# Altium project RFSoC-AMC.PrjPCB (part 12 of 22)

## Sheet CDR_WR_oscillators.SchDoc: RFSoC AMC
size 420 x 297 mm; CmpIndex: 26; CompanyName: WUT; DrawnBy: T. Przywozki; Organization: WUT ISE; Address1: Warsaw University of Technology; Address2: Nowowiejska 15/19 00-665 Warsaw; Address3: Tomasz.Przywozki@pw.edu.pl; DocumentNumber: 45; Revision: 1; SheetNumber: 45; SheetTotal: 45; Project: RFSoC AMC; ModifiedBy: T. Przywozki; CreateDate: -; CheckedDate: -; DivGrp: ISE; Designer: T. Przywozki; ModifiedDate: -; ProjectName: ADC/DAC MEZZANINE
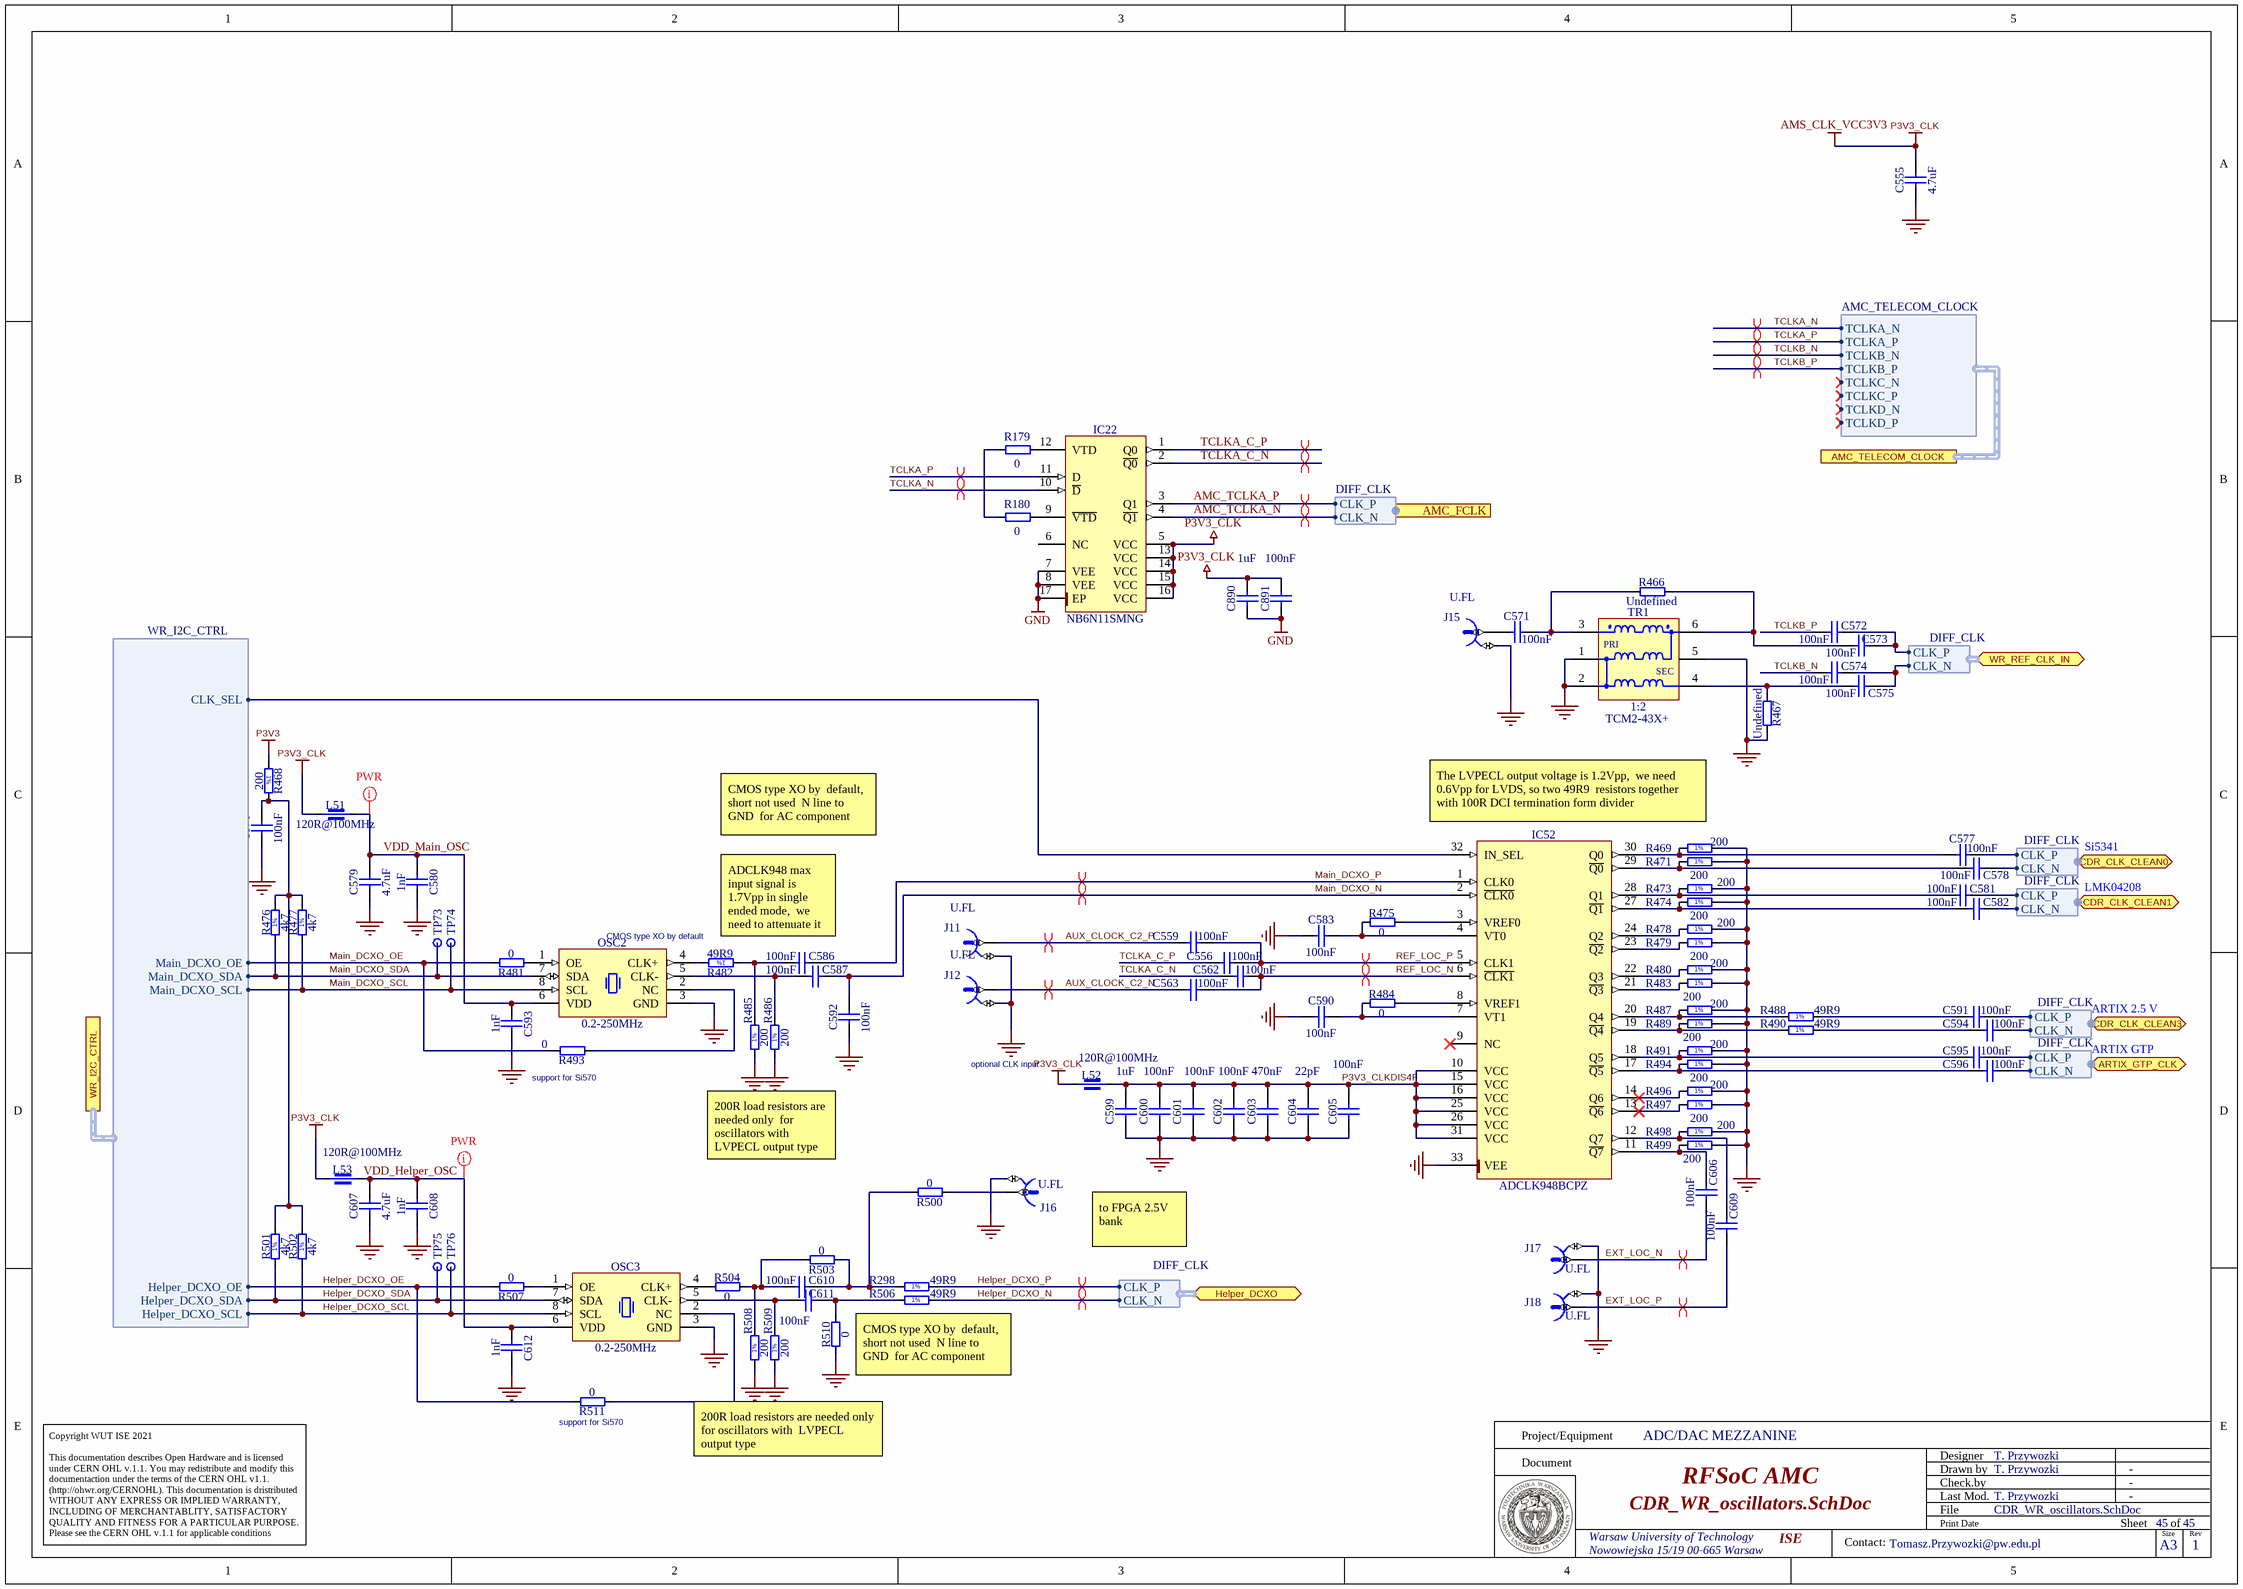
[diagram p25: CDR_WR_oscillators.SchDoc]

### Parts
C555  4.7uF  [CAPC1608X90N]
C556  100nF  [CAPC1005X55N]
C559  100nF  [CAPC1005X55N]
C562  100nF  [CAPC1005X55N]
C563  100nF  [CAPC1005X55N]
C571  100nF  [CAPC1005X55N]
C572  100nF  [CAPC1005X55N]
C573  100nF  [CAPC1005X55N]
C574  100nF  [CAPC1005X55N]
C575  100nF  [CAPC1005X55N]
C576  100nF  [CAPC0603X33N]
C577  100nF  [CAPC0603X33N]
C578  100nF  [CAPC0603X33N]
C579  4.7uF  [CAPC1608X90N]
C580  1nF  [CAPC0603X33N]
C581  100nF  [CAPC0603X33N]
C582  100nF  [CAPC0603X33N]
C583  100nF  [CAPC0603X33N]
C586  100nF  [CAPC1005X55N]
C587  100nF  [CAPC1005X55N]
C590  100nF  [CAPC0603X33N]
C591  100nF  [CAPC0603X33N]
C592  100nF  [CAPC0603X33N]
C593  1nF  [CAPC0603X33N]
C594  100nF  [CAPC0603X33N]
C595  100nF  [CAPC0603X33N]
C596  100nF  [CAPC0603X33N]
C599  1uF  [CAPC1005X55N]
C600  100nF  [CAPC0603X33N]
C601  100nF  [CAPC0603X33N]
C602  100nF  [CAPC0603X33N]
C603  470nF  [CAPC1005X55N]
C604  22pF  [CAPC1005X55N]
C605  100nF  [CAPC0603X33N]
C606  100nF  [CAPC0603X33N]
C607  4.7uF  [CAPC1608X90N]
C608  1nF  [CAPC0603X33N]
C609  100nF  [CAPC0603X33N]
C610  100nF  [CAPC1005X55N]
C611  100nF  [CAPC1005X55N]
C612  1nF  [CAPC0603X33N]
C890  1uF  [CAPC1005X55N]
C891  100nF  [CAPC0603X33N]
IC22  NB6N11SMNG  [QFN50P300X300X100-17N-S185]
IC52  ADCLK948BCPZ  [QFN50P500X500X80-33N-S285]
J11  U.FL  [HIROSE_U.FL-R-SMT-1(10)]
J12  U.FL  [HIROSE_U.FL-R-SMT-1(10)]
J15  U.FL  [HIROSE_U.FL-R-SMT-1(10)]
J16  U.FL  [HIROSE_U.FL-R-SMT-1(10)]
J17  U.FL  [HIROSE_U.FL-R-SMT-1(10)]
J18  U.FL  [HIROSE_U.FL-R-SMT-1(10)]
L51  120R@100MHz  [INDC1608X95N]
L52  120R@100MHz  [INDC1608X95N]
L53  120R@100MHz  [INDC1608X95N]
OSC2  0.2-250MHz  [OSC_SILICON-LAB_SI549-A]
OSC3  0.2-250MHz  [OSC_SILICON-LAB_SI549-A]
R179  0  [RESC1005X40N]
R180  0  [RESC1005X40N]
R298  49R9  [RESC1005X40N]
R466  Undefined  [RESC1005X40N]
R467  Undefined  [RESC1005X40N]
R468  200  [RESC1005X40N]
R469  200  [RESC1005X40N]
R471  200  [RESC1005X40N]
R473  200  [RESC1005X40N]
R474  200  [RESC1005X40N]
R475  0  [RESC1005X40N]
R476  4k7  [RESC1005X40N]
R477  4k7  [RESC1005X40N]
R478  200  [RESC1005X40N]
R479  200  [RESC1005X40N]
R480  200  [RESC1005X40N]
R481  0  [RESC1005X40N]
R482  49R9  [RESC1005X40N]
R483  200  [RESC1005X40N]
R484  0  [RESC1005X40N]
R485  200  [RESC1005X40N]
R486  200  [RESC1005X40N]
R487  200  [RESC1005X40N]
R488  49R9  [RESC1005X40N]
R489  200  [RESC1005X40N]
R490  49R9  [RESC1005X40N]
R491  200  [RESC1005X40N]
R493  0  [RESC1005X40N]
R494  200  [RESC1005X40N]
R496  200  [RESC1005X40N]
R497  200  [RESC1005X40N]
R498  200  [RESC1005X40N]
R499  200  [RESC1005X40N]
R500  0  [RESC1005X40N]
R501  4k7  [RESC1005X40N]
R502  4k7  [RESC1005X40N]
R503  0  [RESC1005X40N]
R504  0  [RESC1005X40N]
R506  49R9  [RESC1005X40N]
R507  0  [RESC1005X40N]
R508  200  [RESC1005X40N]
R509  200  [RESC1005X40N]
R510  0  [RESC1005X40N]
R511  0  [RESC1005X40N]
TP73  Test Point  [TPS127]  (value not drawn)
TP74  Test Point  [TPS127]  (value not drawn)
TP75  Test Point  [TPS127]  (value not drawn)
TP76  Test Point  [TPS127]  (value not drawn)
TR1  1:2  Manufacturer Part Number: TCM2-43X+  [XFMR_MINI-CIRCUITS_DB1627]

### Ports
AMC_FCLK (harness DIFF_CLK), AMC_TELECOM_CLOCK (harness AMC_TELECOM_CLOCK), ARTIX_GTP_CLK (bidir, harness DIFF_CLK), CDR_CLK_CLEAN0 (bidir, harness DIFF_CLK), CDR_CLK_CLEAN1 (bidir, harness DIFF_CLK), CDR_CLK_CLEAN3 (bidir, harness DIFF_CLK), Helper_DCXO (bidir, harness DIFF_CLK), WR_I2C_CTRL (harness WR_I2C_CTRL), WR_REF_CLK_IN (bidir, harness DIFF_CLK)

### Harnesses
AMC_TELECOM_CLOCK: TCLKA_N, TCLKA_P, TCLKB_N, TCLKB_P, TCLKC_N, TCLKC_P, TCLKD_N, TCLKD_P
WR_I2C_CTRL: Main_DCXO_OE, Main_DCXO_SDA, Main_DCXO_SCL, Helper_DCXO_OE, Helper_DCXO_SDA, Helper_DCXO_SCL, CLK_SEL
DIFF_CLK: CLK_P, CLK_N

### Nets
AMS_CLK_VCC3V3: C555.2 C890.1 C891.2 IC22.5(VCC) IC22.13(VCC) IC22.14(VCC) IC22.15(VCC) IC22.16(VCC) L51.1 L52.1 L53.1  [also labelled P3V3_CLK]
GND: C555.1 C576.1 C579.1 C580.1 C583.1 C590.1 C592.1 C593.1 C599.2 C600.1 C601.1 C602.1 C603.1 C604.1 C605.1 C607.1 C608.1 C612.1 C890.2 C891.1 IC22.7(VEE) IC22.8(VEE) IC22.17(EP) IC52.33(VEE) J11.2 J12.2 J15.2 J16.2 J17.2 J18.2 OSC2.3(GND) OSC3.3(GND) R467.1 R469.2 R471.2 R473.2 R474.2 R478.2 R479.2 R480.2 R483.2 R485.1 R486.1 R487.2 R489.2 R491.2 R494.2 R496.2 R497.2 R498.2 R499.2 R508.1 R509.1 R510.1 TR1.1(P1) TR1.2(P1) TR1.5(NC)
P3V3: R468.1
AMC_TCLKA_N: IC22.4(~{Q1}) ; port AMC_FCLK.CLK_N
AMC_TCLKA_P: IC22.3(Q1) ; port AMC_FCLK.CLK_P
AUX_CLOCK_C2_N: C563.1 J12.1
AUX_CLOCK_C2_P: C559.1 J11.1
CDR_CLK_CLEAN2_N: C594.2 ; port CDR_CLK_CLEAN3.CLK_N
CDR_CLK_CLEAN2_P: C591.2 ; port CDR_CLK_CLEAN3.CLK_P
CDR_CLK_CTRL.CDR_CLK_CLEAN1_N: C596.2 ; port ARTIX_GTP_CLK.CLK_N
CDR_CLK_CTRL.CDR_CLK_CLEAN1_P: C595.2 ; port ARTIX_GTP_CLK.CLK_P
CLK_4208_IN1_N: C582.2 ; port CDR_CLK_CLEAN1.CLK_N
CLK_4208_IN1_P: C581.2 ; port CDR_CLK_CLEAN1.CLK_P
EXT_LOC_N: C606.2 J17.1
EXT_LOC_P: C609.2 J18.1
Helper_DCXO_N: R506.2 ; port Helper_DCXO.CLK_N
Helper_DCXO_OE: R507.2 R511.2 ; port WR_I2C_CTRL.Helper_DCXO_OE
Helper_DCXO_P: R298.2 ; port Helper_DCXO.CLK_P
Helper_DCXO_SCL: OSC3.8(SCL) R502.1 TP76.1 ; port WR_I2C_CTRL.Helper_DCXO_SCL
Helper_DCXO_SDA: OSC3.7(SDA) R501.1 TP75.1 ; port WR_I2C_CTRL.Helper_DCXO_SDA
Main_DCXO_N: C587.2 C592.2 IC52.2(~{CLK0})
Main_DCXO_OE: R481.2 R493.2 ; port WR_I2C_CTRL.Main_DCXO_OE
Main_DCXO_P: C586.2 IC52.1(CLK0)
Main_DCXO_SCL: OSC2.8(SCL) R477.1 TP74.1 ; port WR_I2C_CTRL.Main_DCXO_SCL
Main_DCXO_SDA: OSC2.7(SDA) R476.1 TP73.1 ; port WR_I2C_CTRL.Main_DCXO_SDA
P3V3_CLKDIS4F: C599.1 C600.2 C601.2 C602.2 C603.2 C604.2 C605.2 IC52.10(VCC) IC52.15(VCC) IC52.16(VCC) IC52.25(VCC) IC52.26(VCC) IC52.31(VCC) L52.2
REF_LOC_N: C562.2 C563.2 IC52.6(~{CLK1})
REF_LOC_P: C556.2 C559.2 IC52.5(CLK1)
SI5341_CLK_IN_N: C578.2 ; port CDR_CLK_CLEAN0.CLK_N
SI5341_CLK_IN_P: C577.2 ; port CDR_CLK_CLEAN0.CLK_P
TCLKA_C_N: C562.1 IC22.2(~{Q0})
TCLKA_C_P: C556.1 IC22.1(Q0)
TCLKA_N: IC22.10(~{D}) ; port AMC_TELECOM_CLOCK.TCLKA_N
TCLKA_P: IC22.11(D) ; port AMC_TELECOM_CLOCK.TCLKA_P
TCLKB_N: C574.1 ; port AMC_TELECOM_CLOCK.TCLKB_N
TCLKB_P: C572.1 ; port AMC_TELECOM_CLOCK.TCLKB_P
VDD_Helper_OSC: C607.2 C608.2 C612.2 L53.2 OSC3.6(VDD)
VDD_Main_OSC: C579.2 C580.2 C593.2 L51.2 OSC2.6(VDD)
WR_CLK_SEL: IC52.32(IN_SEL) ; port WR_I2C_CTRL.CLK_SEL
WR_REF_CLK_IN_N: C574.2 C575.2 ; port WR_REF_CLK_IN.CLK_N
WR_REF_CLK_IN_P: C572.2 C573.2 ; port WR_REF_CLK_IN.CLK_P
NetC571_1: C571.1 J15.1
NetC571_2: C571.2 R466.2 TR1.3(P1)
NetC573_1: C573.1 R466.1 TR1.6(S1)
NetC575_1: C575.1 R467.2 TR1.4(S1)
NetC576_2: C576.2 R468.2 R476.2 R477.2 R501.2 R502.2
NetC577_1: C577.1 IC52.30(Q0) R469.1
NetC578_1: C578.1 IC52.29(~{Q0}) R471.1
NetC581_1: C581.1 IC52.28(Q1) R473.1
NetC582_1: C582.1 IC52.27(~{Q1}) R474.1
NetC583_2: C583.2 IC52.4(VT0) R475.1
NetC586_1: C586.1 R482.1 R485.2
NetC587_1: C587.1 OSC2.5(CLK-) R486.2
NetC590_2: C590.2 IC52.7(VT1) R484.1
NetC591_1: C591.1 R488.2
NetC594_1: C594.1 R490.2
NetC595_1: C595.1 IC52.18(Q5) R491.1
NetC596_1: C596.1 IC52.17(~{Q5}) R494.1
NetC606_1: C606.1 IC52.11(~{Q7}) R499.1
NetC609_1: C609.1 IC52.12(Q7) R498.1
NetC610_1: C610.1 R503.2 R504.2 R508.2
NetC610_2: C610.2 R298.1 R500.2 R503.1
NetC611_1: C611.1 OSC3.5(CLK-) R509.2
NetC611_2: C611.2 R506.1 R510.2
NetIC22_9: IC22.9(~{VTD}) R180.2
NetIC22_12: IC22.12(VTD) R179.2
NetIC52_3: IC52.3(VREF0) R475.2
NetIC52_8: IC52.8(VREF1) R484.2
NetIC52_13: IC52.13(~{Q6}) R497.1
NetIC52_14: IC52.14(Q6) R496.1
NetIC52_19: IC52.19(~{Q4}) R489.1 R490.1
NetIC52_20: IC52.20(Q4) R487.1 R488.1
NetIC52_21: IC52.21(~{Q3}) R483.1
NetIC52_22: IC52.22(Q3) R480.1
NetIC52_23: IC52.23(~{Q2}) R479.1
NetIC52_24: IC52.24(Q2) R478.1
NetJ16_1: J16.1 R500.1
NetOSC2_1: OSC2.1(OE) R481.1
NetOSC2_2: OSC2.2(NC) R493.1
NetOSC2_4: OSC2.4(CLK+) R482.2
NetOSC3_1: OSC3.1(OE) R507.1
NetOSC3_2: OSC3.2(NC) R511.1
NetOSC3_4: OSC3.4(CLK+) R504.1
NetR179_1: R179.1 R180.1

Not connected (* = marked no-connect by the designer): IC22 6(NC); IC52 9(NC)*

### Layout directives
differential pair; differential pair class 100Ohm: AMC_TCLKA_N, AMC_TCLKA_P, AUX_CLOCK_C2_N, AUX_CLOCK_C2_P, EXT_LOC_N, EXT_LOC_P, Helper_DCXO_N, Helper_DCXO_P, Main_DCXO_N, Main_DCXO_P, REF_LOC_N, REF_LOC_P, TCLKA_C_N, TCLKA_C_P
differential pair: TCLKA_N, TCLKA_P, TCLKB_N, TCLKB_P
net class PWR: VDD_Helper_OSC, VDD_Main_OSC

### Notes on the sheet
- CMOS type XO by  default, short not used  N line to GND  for AC component
- The LVPECL output voltage is 1.2Vpp,  we need 0.6Vpp for LVDS, so two 49R9  resistors together with 100R DCI termination form divider
- Si5341
- CMOS type XO by default
- ADCLK948 max input signal is 1.7Vpp in single  ended mode,  we need to attenuate it
- LMK04208
- (near L52) optional CLK input
- ARTIX 2.5 V
- ARTIX GTP
- (near R493) support for Si570
- 200R load resistors are needed only  for oscillators with  LVPECL output type
- to FPGA 2.5V bank
- (near R511) support for Si570
- Project/Equipment
- Document
- Designer
- Drawn by
- Check.by
- Copyright WUT ISE 2021
  This documentation describes Open Hardware and is licensed under CERN OHL v.1.1. You may redistribute and modify this documentaction under the terms of the CERN OHL v1.1.
  (http://ohwr.org/CERNOHL). This documentation is dristributed WITHOUT ANY EXPRESS OR IMPLIED WARRANTY, INCLUDING OF MERCHANTABLITY, SATISFACTORY QUALITY AND FITNESS FOR A PARTICULAR PURPOSE. Please see the CERN OHL v.1.1 for applicable conditions
- File
- Last Mod.
- Print Date
- Sheet
- Size
- A3
- of
- Rev
- Contact:
- (in symbol R0402_4K7_1%_0.0625W_100PPM) 1%
- (in symbol R0402_49R9_1%_0.0625W_100PPM) 1%
- (in symbol R0402_200R_1%_0.0625W_100PPM) 1%
- (in symbol XFMR_MINI-CIRCUITS_TCM2-43X+) PRI; SEC

### Library data of the parts
C555 C579 C607 = CC0603_4.7UF_25V_10%_X5R: Non-polarised capacitor; Manufacturer: GENERIC; Part Description: SMD Multilayer Chip Ceramic Capacitor; Manufacturer1 Part Number: GRM188R61E475KE11D; Tolerance: ±10%; Voltage: 25V; TC: X5R; Manufacturer Part Number: CC0603_4.7UF_25V_10%_X5R; Part Number: CC0603_4.7UF_25V_10%_X5R; Value: 4.7uF; Component Kind: Standard; Component Type: Standard; Pin Count: 2; Status: None; Case: 0603; Mounted: Yes; Socket: No; SMD: Yes; Sense: No; Manufacturer1 Example: MURATA; Manufacturer1 ComponentHeight: 0.95mm; HelpURL: \\cern.ch\dfs\Applications\Altium\Datasheets\CC0603_MURATA_GRM188R61E475KE11D.pdf; Author: CERN DEM JLC; CreateDate: 10.11.2014; LatestRevisionDate: 10.11.2014
C556 C559 C562 C563 C571-C575 C586 C587 C610 C611 = CC0402_100NF_16V_10%_X5R: Non-polarised capacitor; Manufacturer: GENERIC; Manufacturer1 Part Number: GRM155R61C104KA88D; Part Description: SMD Multilayer Chip Ceramic Capacitor; TC: X5R; Tolerance: ±10%; Voltage: 16V; Case: 0402; Manufacturer Part Number: CC0402_100NF_16V_10%_X5R; Manufacturer1 Example: MURATA; Part Number: CC0402_100NF_16V_10%_X5R; Pin Count: 2; SMD: Yes; Status: None; Value: 100nF; Component Kind: Standard; Component Type: Standard; Mounted: Yes; Socket: No; Sense: No; Manufacturer1 ComponentHeight: 0.55mm; HelpURL: \\cern.ch\dfs\Applications\Altium\Datasheets\CC0402_X5R_MURATA_GRM.pdf; Author: CERN DEM JLC; CreateDate: 10.12.2013; LatestRevisionDate: 10.12.2013
C576-C578 C581-C583 C590-C592 C594-C596 C600-C602 C605 C606 C609 C891 = CC0201_100NF_6.3V_10%_X5R: Non-polarised capacitor; Manufacturer: GENERIC; Part Description: SMD Multilayer Chip Ceramic Capacitor; Manufacturer1 Part Number: 02016D104KAT2A; Tolerance: ±10%; Voltage: 6.3V; TC: X5R; Manufacturer Part Number: CC0201_100NF_6.3V_10%_X5R; Part Number: CC0201_100NF_6.3V_10%_X5R; Value: 100nF; Component Kind: Standard; Component Type: Standard; Pin Count: 2; Status: Not Recommended; Case: 0201; Mounted: Yes; Socket: No; SMD: Yes; Sense: No; Manufacturer1 Example: AVX; Manufacturer1 ComponentHeight: 0.33mm; HelpURL: \\cern.ch\dfs\Applications\Altium\Datasheets\CC0201_X5R_AVX.pdf; Author: CERN DEM JLC; CreateDate: 03.12.2007; LatestRevisionDate: 03.12.2007
C580 C593 C608 C612 = CC0201_1NF_16V_10%_X5R: Non-polarised capacitor; Manufacturer: GENERIC; Part Description: SMD Multilayer Chip Ceramic Capacitor; Manufacturer1 Part Number: 0201YD102KAT2A; Tolerance: ±10%; Voltage: 16V; TC: X5R; Manufacturer Part Number: CC0201_1NF_16V_10%_X5R; Part Number: CC0201_1NF_16V_10%_X5R; Value: 1nF; Component Kind: Standard; Component Type: Standard; Pin Count: 2; Status: Not Recommended; Case: 0201; Mounted: Yes; Socket: No; SMD: Yes; Sense: No; Manufacturer1 Example: AVX; Manufacturer1 ComponentHeight: 0.33mm; HelpURL: \\cern.ch\dfs\Applications\Altium\Datasheets\CC0201_X5R_AVX.pdf; Author: CERN DEM JLC; CreateDate: 03.12.2007; LatestRevisionDate: 03.12.2007
C599 C890 = CC0402_1UF_16V_10%_X5R: Non-polarised capacitor; Manufacturer: GENERIC; Part Description: SMD Multilayer Chip Ceramic Capacitor; Manufacturer1 Part Number: C1005X5R1C105KT; Tolerance: ±10%; Voltage: 16V; TC: X5R; Manufacturer Part Number: CC0402_1UF_16V_10%_X5R; Part Number: CC0402_1UF_16V_10%_X5R; Value: 1uF; Component Kind: Standard; Component Type: Standard; Pin Count: 2; Status: Preferred; Case: 0402; Mounted: Yes; Socket: No; SMD: Yes; Sense: No; Manufacturer1 Example: TDK; Manufacturer1 ComponentHeight: 0.55mm; HelpURL: \\cern.ch\dfs\Applications\Altium\Datasheets\CC0402_X5R_TDK_C.pdf; Author: CERN DEM JLC; CreateDate: 25.10.2012; LatestRevisionDate: 25.10.2012
C603 = CC0402_470NF_16V_10%_X5R: Non-polarised capacitor; Manufacturer: GENERIC; Part Description: SMD Multilayer Chip Ceramic Capacitor; Manufacturer1 Part Number: C1005X5R1C105KT; Tolerance: ±10%; Voltage: 16V; TC: X5R; Manufacturer Part Number: CC0402_470NF_16V_10%_X5R; Part Number: CC0402_470NF_16V_10%_X5R; Value: 470nF; Component Kind: Standard; Component Type: Standard; Pin Count: 2; Status: Preferred; Case: 0402; Mounted: Yes; Socket: No; SMD: Yes; Sense: No; Manufacturer1 Example: TDK; Manufacturer1 ComponentHeight: 0.55mm; HelpURL: \\cern.ch\dfs\Applications\Altium\Datasheets\CC0402_X5R_TDK_C.pdf; Author: CERN DEM JLC; CreateDate: 25.10.2012; LatestRevisionDate: 25.10.2012
C604 = CC0402_22PF_50V_5%_C0G: Non-polarised capacitor; Manufacturer: GENERIC; Part Description: SMD Multilayer Chip Ceramic Capacitor; Manufacturer1 Part Number: C0402C220J5GACTU; Tolerance: ±5%; Voltage: 50V; TC: C0G/NP0; Manufacturer Part Number: CC0402_22PF_50V_5%_C0G; Part Number: CC0402_22PF_50V_5%_C0G; Value: 22pF; Component Kind: Standard; Component Type: Standard; Pin Count: 2; Status: Preferred; Case: 0402; Mounted: Yes; Socket: No; SMD: Yes; Sense: No; Manufacturer1 Example: KEMET; Manufacturer1 ComponentHeight: 0.55mm; HelpURL: \\cern.ch\dfs\Applications\Altium\Datasheets\CC0805_C0G_KEMET_(Commercial Grade).pdf; Author: CERN DEM JLC; CreateDate: 03.12.2007; LatestRevisionDate: 03.12.2007
IC22 = NB6N11SMNG: 3.3V 1:2 AnyLevel Input to LVDS Fanout Buffer / Translator; Manufacturer: ON SEMICONDUCTOR; PressFit: No; Bonding: No; Part Number: NB6N11SMNG; Component Kind: Standard; Component Type: Standard; Device: NB6N11SMNG; PackageDescription: QFN, 0.50mm Pitch, Square; 16 Pin, 3.00mm L X 3.00mm W X 1.00mm H body (w/Thermal Tab 1.85 X 1.85mm), IPC Medium Density; Part Description: 3.3V 1:2 AnyLevel Input to LVDS Fanout Buffer / Translator; Manufacturer Part Number: NB6N11SMNG; Pin Count: 17; Case: QFN16; Mounted: Yes; Socket: No; SMD: Yes; Sense: No; ComponentHeight: 1mm; Author: CERN DEM JLC; HelpURL: \\cern.ch\dfs\Applications\Altium\Datasheets\NB6N11SMNG.pdf; CreateDate: 14.05.2013; LatestRevisionDate: 14.05.2013
IC52 = ADCLK948BCPZ: Two Selectable Inputs, 8 LVPECL Outputs, SiGe Clock Fanout Buffer; Manufacturer: ANALOG DEVICES; PressFit: No; Bonding: No; Manufacturer Part Number: ADCLK948BCPZ; Part Description: Two Selectable Inputs, 8 LVPECL Outputs, SiGe Clock Fanout Buffer; Part Number: ADCLK948BCPZ; Component Kind: Standard; Component Type: Standard; Device: ADCLK948BCPZ; PackageDescription: QFN, 0.50mm Pitch, Square; 8 Pin X 8 Pin, 5mm X 5mm X 1.00mm H body (w/thermal tab 2.85 X 2.85mm),  IPC Medium Density; Pin Count: 33; Case: QFN32; Mounted: Yes; Socket: No; SMD: Yes; Sense: No; ComponentHeight: 0.8mm; Author: CERN DEM MR; HelpURL: \\cern.ch\dfs\Applications\Altium\Datasheets\ADCLK948BCPZ.pdf; CreateDate: 30.11.2016; LatestRevisionDate: 30.11.2016
J11 J12 J15-J18 = HIROSE_U.FL-R-SMT-1(10): Manufacturer: HIROSE (HRS); Part Description: Up to 6GHz Ultra Small Surface Mount Male Coaxial Connectors U.FL Series; PressFit: No; Manufacturer Part Number: U.FL-R-SMT-1(10); Part Number: HIROSE_U.FL-R-SMT-1(10); Component Kind: Standard; Component Type: Standard; Pin Count: 2; Family: U.FL; Mounted: Yes; Socket: No; SMD: Yes; Sense: No; Status: None; ComponentHeight: 1.25mm; HelpURL: \\cern.ch\dfs\Applications\Altium\Datasheets\HIROSE_U.FL-R-SMT-1(10).pdf; Author: CERN DEM JLC; CreateDate: 24.03.2010; LatestRevisionDate: 24.03.2010
L51-L53 = IND0603_MURATA_BLM18PG121SN1D: as L1-L3 on sheet Supply; Manufacturer Part Number: BLM18PG121SN1D; Part Number: IND0603_MURATA_BLM18PG121SN1D; Value: 120R@100MHz; Component Kind: Standard; Component Type: Standard; Pin Count: 2; Status: None; Case: 0603; Mounted: Yes; Socket: No; SMD: Yes; Sense: No; ComponentHeight: 0.95mm; HelpURL: \\cern.ch\dfs\Applications\Altium\Datasheets\IND0603_MURATA_BLM18P.pdf; Author: CERN DEM BC; CreateDate: 27.07.2015; LatestRevisionDate: 25.10.2018
OSC2 OSC3 = OSC_0.2-250MHZ_SILICON-LAB_549CBAC000112ABG: Any-Rate I2C Programmable XO Oscillator Si549 Series; Part Description: 0.2-250MHz, 1.8V/2.5V/3.3V ±10ppm CMOS , Any-Rate I2C Programmable XO Oscillator Si549 Series; Manufacturer: SILICON LABS; PressFit: No; Bonding: No; Part Number: OSC_0.2-250MHZ_SILICON-LAB_549CBAC000112ABG; Component Kind: Standard; Component Type: Standard; PackageDescription: Oscillator Si549 Series, 8 pins, 5x7mm; Value: 0.2-250MHz; Manufacturer Part Number: 549CBAC000112ABG; Pin Count: 8; Mounted: Yes; Socket: No; SMD: Yes; Sense: No; ComponentHeight: 1.33mm; HelpURL: \\cern.ch\dfs\Applications\Altium\Datasheets\OSC_SILICON-LAB_SI549.pdf; Author: CERN DEM BC; CreateDate: 25.10.2019; LatestRevisionDate: 25.10.2019
R179 R180 = R0402_0R_JUMPER: Resistor; Part Description: 1A (0.05R Max DC Resistance) Zero Ohm Jumper; Manufacturer: GENERIC; Manufacturer1 Part Number: 232270591001L; PressFit: No; Part Number: R0402_0R_JUMPER; Component Kind: Standard; Component Type: Standard; Pin Count: 2; Value: 0; Status: Not Recommended; Manufacturer Part Number: R0402_0R_JUMPER; Case: 0402; Mounted: Yes; Sense: No; Socket: No; SMD: Yes; Manufacturer1 Example: YAGEO PHYCOMP; Manufacturer1 ComponentHeight: 0.4mm; HelpURL: \\cern.ch\dfs\Applications\Altium\Datasheets\R0402_Phycomp_RC0402.pdf; Author: CERN DEM JLC; CreateDate: 03.12.2007; LatestRevisionDate: 17.10.2012
R298 R482 R488 R490 R506 = R0402_49R9_1%_0.0625W_100PPM: Resistor - 1%; Manufacturer: GENERIC; Part Description: General Purpose Thick Film Chip Resistor; Manufacturer1 Part Number: 232270674999L or RC0402FR-0749R9L; TC: ±100ppm/°C; PressFit: No; Manufacturer Part Number: R0402_49R9_1%_0.0625W_100PPM; Part Number: R0402_49R9_1%_0.0625W_100PPM; Tolerance: ±1%; Value: 49R9; Component Kind: Standard; Component Type: Standard; Pin Count: 2; Status: Not Recommended; Power: 0.0625W; Case: 0402; Mounted: Yes; Sense: No; Socket: No; SMD: Yes; Manufacturer1 Example: YAGEO PHYCOMP; Manufacturer1 ComponentHeight: 0.4mm; HelpURL: \\cern.ch\dfs\Applications\Altium\Datasheets\R0402_Phycomp_RC0402.pdf; Author: CERN DEM JLC; CreateDate: 24.10.2012; LatestRevisionDate: 24.10.2012
R466 R467 = R0402_NO-VALUE: Resistor; Part Description: Reserved Footprint For a 0402 (1005) Chip Resistor; PressFit: No; Mounted: No; Manufacturer Part Number: R0402_NO-VALUE; Manufacturer: Undefined; Part Number: R0402_NO-VALUE; Value: Undefined; Component Kind: Standard; Component Type: Standard; Pin Count: 2; Status: None; Case: 0402; Sense: No; Socket: No; SMD: Yes; Manufacturer1 Example: Undefined; Manufacturer1 Part Number: Undefined; Manufacturer1 ComponentHeight: Undefined; HelpURL: Undefined; Author: CERN DEM JLC; CreateDate: 03.12.2007; LatestRevisionDate: 13.03.2008
R468 R469 R471 R473 R474 R478-R480 R483 R485-R487 R489 R491 R494 R496-R499 R508 R509 = R0402_200R_1%_0.0625W_100PPM: Resistor - 1%; Manufacturer: GENERIC; Part Description: General Purpose Thick Film Chip Resistor; Manufacturer1 Part Number: 232270672001L; TC: ±100ppm/°C; PressFit: No; Manufacturer Part Number: R0402_200R_1%_0.0625W_100PPM; Part Number: R0402_200R_1%_0.0625W_100PPM; Tolerance: ±1%; Value: 200; Component Kind: Standard; Component Type: Standard; Pin Count: 2; Status: Not Recommended; Power: 0.0625W; Case: 0402; Mounted: Yes; Sense: No; Socket: No; SMD: Yes; Manufacturer1 Example: YAGEO PHYCOMP; Manufacturer1 ComponentHeight: 0.4mm; HelpURL: \\cern.ch\dfs\Applications\Altium\Datasheets\R0402_Phycomp_RC0402.pdf; Author: CERN DEM JLC; CreateDate: 03.12.2007; LatestRevisionDate: 17.10.2012
R475 R481 R484 R493 R500 R503 R504 R507 R510 R511 = R0402_0R_JUMPER: as R105 on sheet Supply; Manufacturer Part Number: R0402_0R_JUMPER; Part Number: R0402_0R_JUMPER; Value: 0; Component Kind: Standard; Component Type: Standard; Pin Count: 2; Status: Not Recommended; Case: 0402; Mounted: Yes; Sense: No; Socket: No; SMD: Yes; Manufacturer1 Example: YAGEO PHYCOMP; Manufacturer1 ComponentHeight: 0.4mm; HelpURL: \\cern.ch\dfs\Applications\Altium\Datasheets\R0402_Phycomp_RC0402.pdf; Author: CERN DEM JLC; CreateDate: 03.12.2007; LatestRevisionDate: 17.10.2012
R476 R477 R501 R502 = R0402_4K7_1%_0.0625W_100PPM: Resistor - 1%; Manufacturer: GENERIC; Part Description: General Purpose Thick Film Chip Resistor; Manufacturer1 Part Number: 232270674702L; TC: ±100ppm/°C; PressFit: No; Manufacturer Part Number: R0402_4K7_1%_0.0625W_100PPM; Part Number: R0402_4K7_1%_0.0625W_100PPM; Tolerance: ±1%; Value: 4k7; Component Kind: Standard; Component Type: Standard; Pin Count: 2; Status: Not Recommended; Power: 0.0625W; Case: 0402; Mounted: Yes; Sense: No; Socket: No; SMD: Yes; Manufacturer1 Example: YAGEO PHYCOMP; Manufacturer1 ComponentHeight: 0.4mm; HelpURL: \\cern.ch\dfs\Applications\Altium\Datasheets\R0402_Phycomp_RC0402.pdf; Author: CERN DEM JLC; CreateDate: 03.12.2007; LatestRevisionDate: 17.10.2012
TP73-TP76 = SMD_PAD_1.27X1.27MM: Part Description: 1.27mm x 1.27mm PCB Copper Area (SMD Test Point); Mounted: No; Part Number: SMD_PAD_1.27X1.27MM; Component Kind: Standard (No BOM); Component Type: Standard (No BOM); Pin Count: 1; Family: Test Point; Socket: No; SMD: Yes; Sense: No; Status: None; ComponentHeight: 0mm; HelpURL: Undefined; Author: CERN DEM JLC; CreateDate: 12.01.2008; LatestRevisionDate: 12.01.2008; PackageDescription: 1.27mm x 1.27mm PCB Copper Area (SMD Test Point)
TR1 = XFMR_MINI-CIRCUITS_TCM2-43X+: 50 OHMS 10 to 4000 MHz RF Transformer; Power: 0.4W; Part Number: XFMR_MINI-CIRCUITS_TCM2-43X+; Component Kind: Standard; Component Type: Standard; Pin Count: 6; Value: 1:2; Status: None; Part Description: 50 Ohms 10 to 4000MHz RF Transformer; Manufacturer: MINI-CIRCUITS; Mounted: Yes; Socket: No; Sense: No; SMD: Yes; ComponentHeight: 4.06mm; HelpURL: \\cern.ch\dfs\Applications\Altium\Datasheets\XFMR_MINI-CIRCUITS_TCM2-43X+.pdf; Author: CERN DEM BC; CreateDate: 12.02.2016; LatestRevisionDate: 12.02.2016

## Sheet SoC_FPGA_67_68_69_DDR4.SchDoc: RFSoC AMC
size 420 x 297 mm; CompanyName: WUT; DrawnBy: T. Przywozki; Organization: WUT ISE; Address1: Warsaw University of Technology; Address2: Nowowiejska 15/19 00-665 Warsaw; Address3: Tomasz.Przywozki@pw.edu.pl; DocumentNumber: 4; Revision: 1; SheetNumber: 4; SheetTotal: 45; Project: RFSoC AMC; ModifiedBy: T. Przywozki; CreateDate: -; CheckedDate: -; DivGrp: ISE; Designer: T. Przywozki; ModifiedDate: -; ProjectName: ADC/DAC MEZZANINE
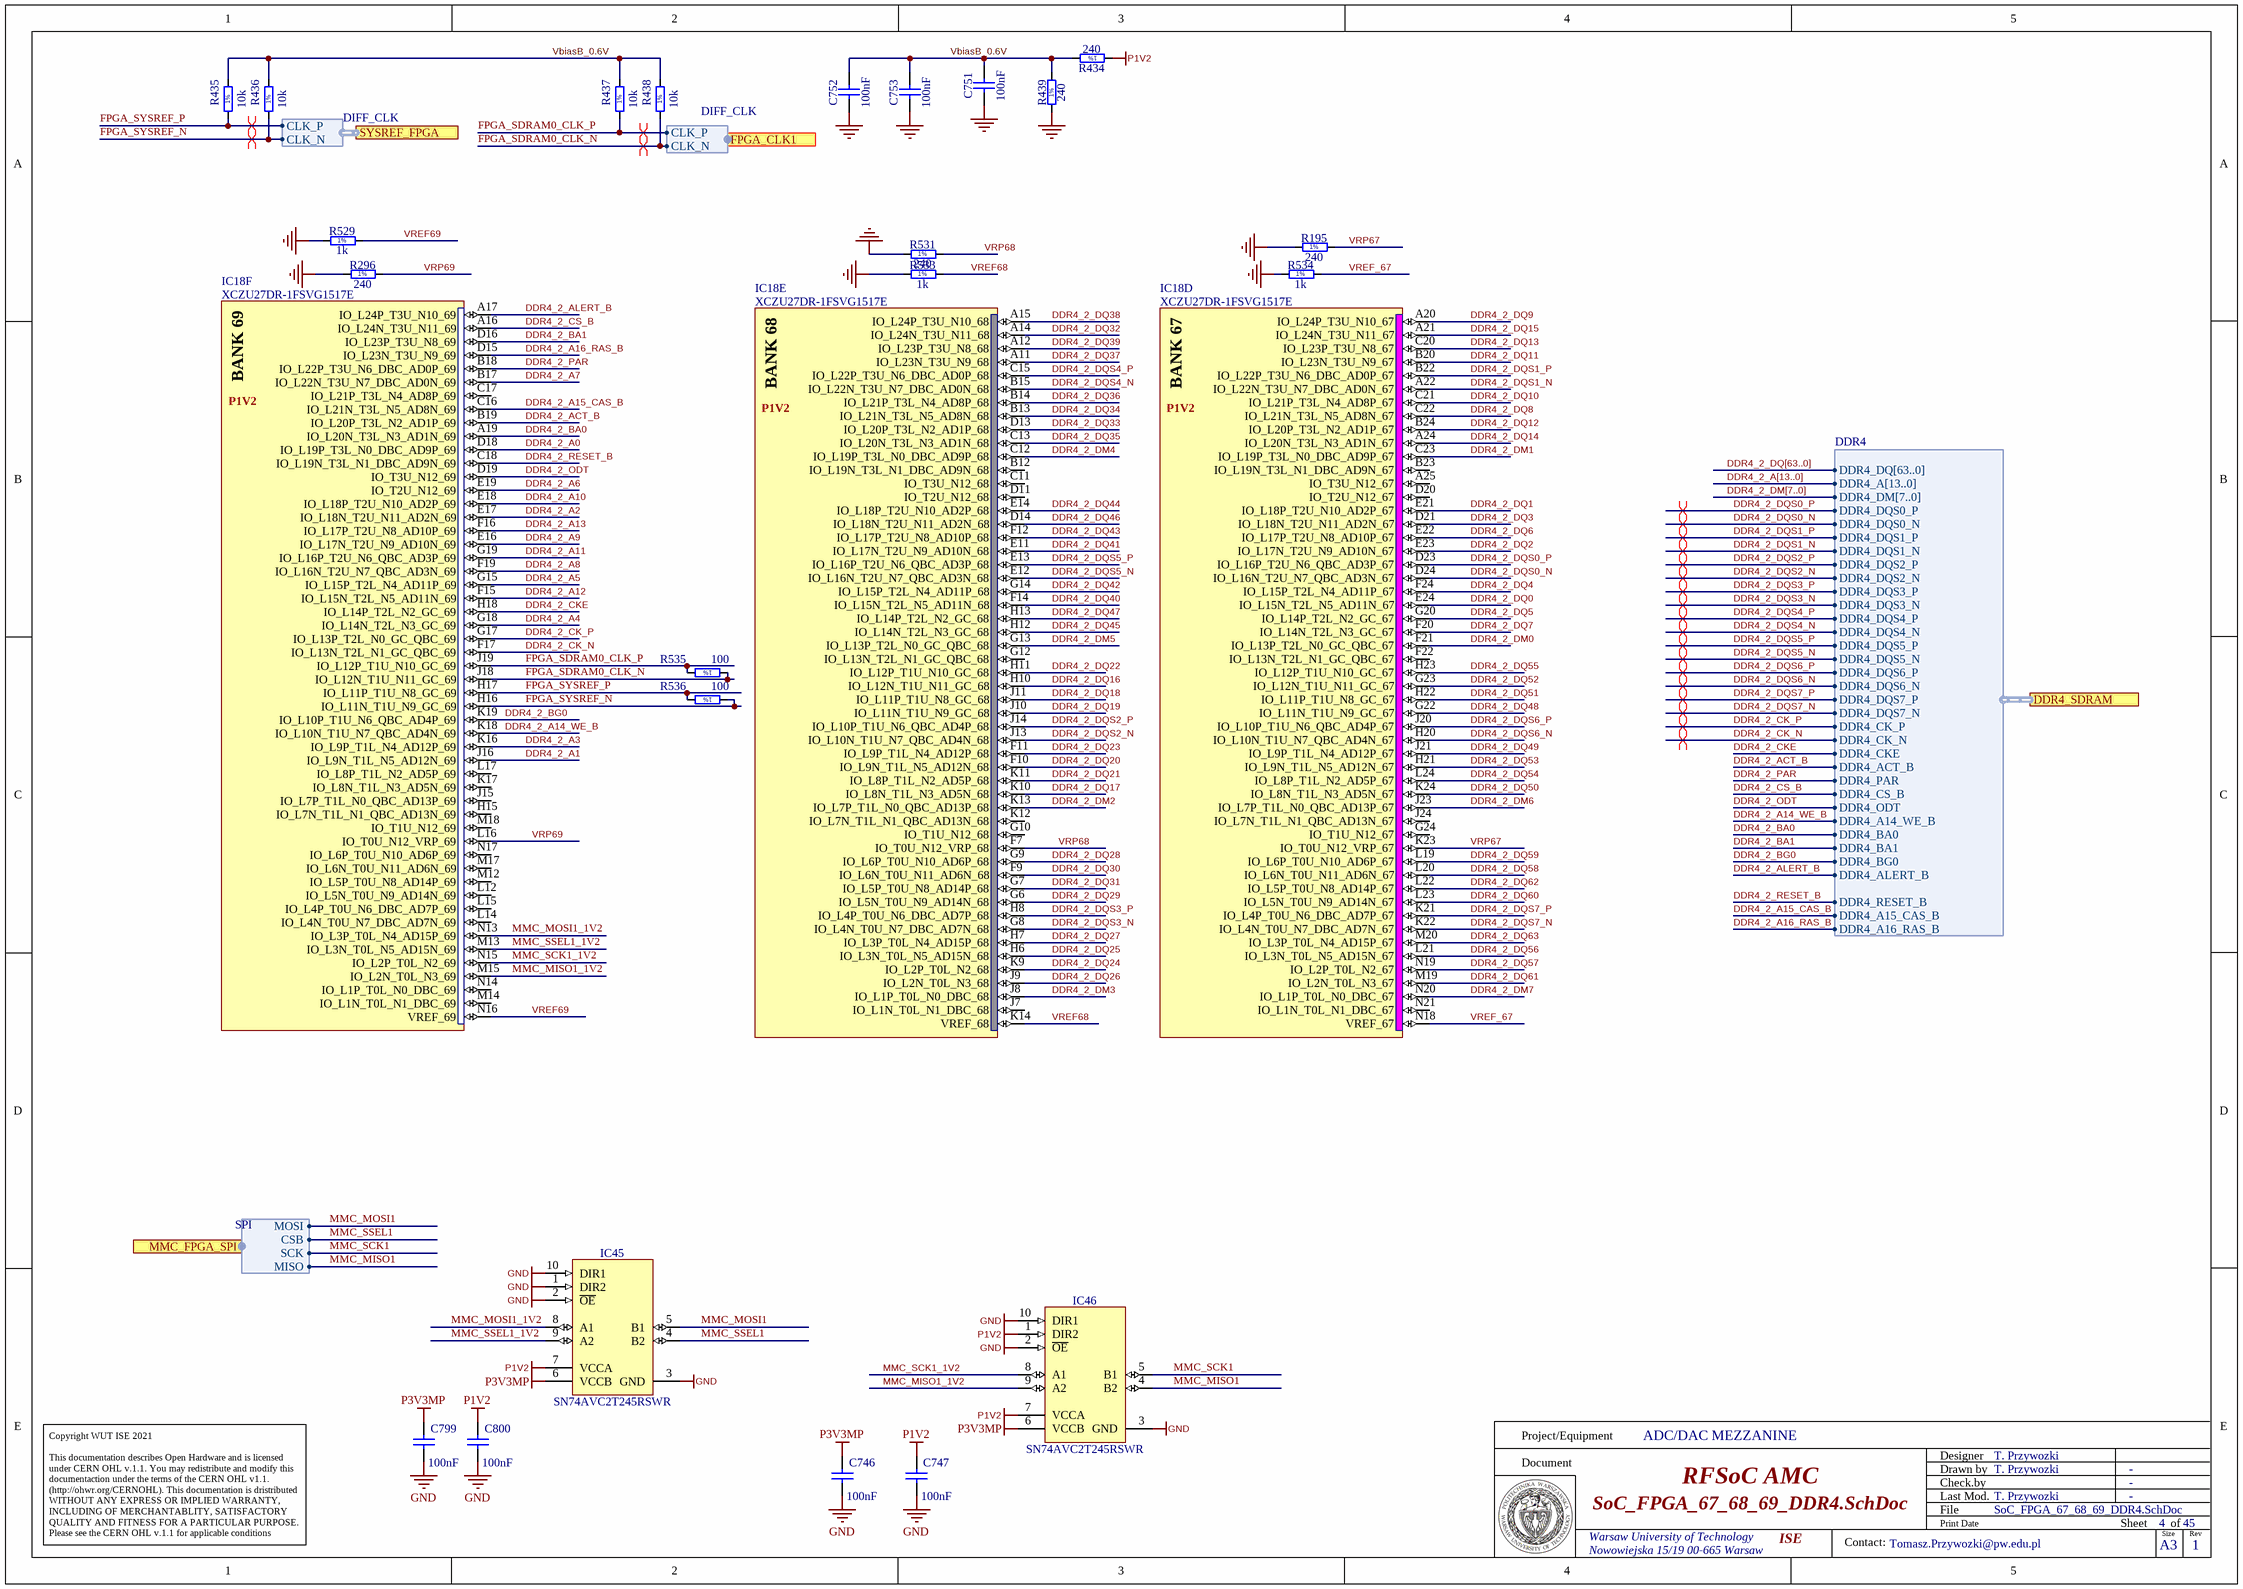
[diagram p26: SoC_FPGA_67_68_69_DDR4.SchDoc]

### Parts
C746  100nF  [CAPC0603X33N]
C747  100nF  [CAPC0603X33N]
C751  100nF  [CAPC0603X33N]
C752  100nF  [CAPC0603X33N]
C753  100nF  [CAPC0603X33N]
C799  100nF  [CAPC0603X33N]
C800  100nF  [CAPC0603X33N]
IC18  XCZU27DR-1FSVG1517E  [XILINX_FSVG1517 (XCZU27DR)]  (parts D,E,F of 31)
IC45  SN74AVC2T245RSWR  [QFN40P140X180X55-10N]
IC46  SN74AVC2T245RSWR  [QFN40P140X180X55-10N]
R195  240  [RESC1005X40N]
R296  240  [RESC1005X40N]
R434  240  [RESC1005X40N]
R435  10k  [RESC1005X40N]
R436  10k  [RESC1005X40N]
R437  10k  [RESC1005X40N]
R438  10k  [RESC1005X40N]
R439  240  [RESC1005X40N]
R529  1k  [RESC1005X40N]
R531  240  [RESC1005X40N]
R533  1k  [RESC1005X40N]
R534  1k  [RESC1005X40N]
R535  100  [RESC1005X40N]
R536  100  [RESC1005X40N]

### Ports
DDR4_SDRAM (harness DDR4), FPGA_CLK1 (out, harness DIFF_CLK), MMC_FPGA_SPI (harness SPI), SYSREF_FPGA (harness DIFF_CLK)

### Harnesses
DDR4: DDR4_DQ[63..0], DDR4_A[13..0], DDR4_DM[7..0], DDR4_DQS0_P, DDR4_DQS0_N, DDR4_DQS1_P, DDR4_DQS1_N, DDR4_DQS2_P, DDR4_DQS2_N, DDR4_DQS3_P, DDR4_DQS3_N, DDR4_DQS4_P, DDR4_DQS4_N, DDR4_DQS5_P, DDR4_DQS5_N, DDR4_DQS6_P, DDR4_DQS6_N, DDR4_DQS7_P, DDR4_DQS7_N, DDR4_CK_P, DDR4_CK_N, DDR4_CKE, DDR4_ACT_B, DDR4_PAR, DDR4_CS_B, DDR4_ODT, DDR4_A14_WE_B, DDR4_BA0, DDR4_BA1, DDR4_BG0, DDR4_ALERT_B, DDR4_RESET_B, DDR4_A15_CAS_B, DDR4_A16_RAS_B
DIFF_CLK: CLK_P, CLK_N
SPI: SCK, CSB, MISO, MOSI

### Nets
GND: C746.1 C747.1 C751.2 C752.2 C753.2 C799.1 C800.1 IC45.1(DIR2) IC45.2(~{OE}) IC45.3(GND) IC45.10(DIR1) IC46.2(~{OE}) IC46.3(GND) IC46.10(DIR1) R195.1 R296.1 R439.1 R529.1 R531.1 R533.1 R534.1
P1V2: C747.2 C800.2 IC45.7(VCCA) IC46.1(DIR2) IC46.7(VCCA) R434.1
P3V3MP: C746.2 C799.2 IC45.6(VCCB) IC46.6(VCCB)
DDR4_2_A0: IC18.D18(IO_L19P_T3L_N0_DBC_AD9P_69)
DDR4_2_A1: IC18.J16(IO_L9N_T1L_N5_AD12N_69)
DDR4_2_A2: IC18.E17(IO_L18N_T2U_N11_AD2N_69)
DDR4_2_A3: IC18.K16(IO_L9P_T1L_N4_AD12P_69)
DDR4_2_A4: IC18.G18(IO_L14N_T2L_N3_GC_69)
DDR4_2_A5: IC18.G15(IO_L15P_T2L_N4_AD11P_69)
DDR4_2_A6: IC18.E19(IO_T2U_N12_69)
DDR4_2_A7: IC18.B17(IO_L22N_T3U_N7_DBC_AD0N_69)
DDR4_2_A8: IC18.F19(IO_L16N_T2U_N7_QBC_AD3N_69)
DDR4_2_A9: IC18.E16(IO_L17N_T2U_N9_AD10N_69)
DDR4_2_A10: IC18.E18(IO_L18P_T2U_N10_AD2P_69)
DDR4_2_A11: IC18.G19(IO_L16P_T2U_N6_QBC_AD3P_69)
DDR4_2_A12: IC18.F15(IO_L15N_T2L_N5_AD11N_69)
DDR4_2_A13: IC18.F16(IO_L17P_T2U_N8_AD10P_69)
DDR4_2_A14_WE_B: IC18.K18(IO_L10N_T1U_N7_QBC_AD4N_69) ; port DDR4_SDRAM.DDR4_A14_WE_B  [project net DDR4_PL0.DDR4_A14_WE_B]
DDR4_2_A15_CAS_B: IC18.C16(IO_L21N_T3L_N5_AD8N_69) ; port DDR4_SDRAM.DDR4_A15_CAS_B  [project net DDR4_PL0.DDR4_A15_CAS_B]
DDR4_2_A16_RAS_B: IC18.D15(IO_L23N_T3U_N9_69) ; port DDR4_SDRAM.DDR4_A16_RAS_B  [project net DDR4_PL0.DDR4_A16_RAS_B]
DDR4_2_ACT_B: IC18.B19(IO_L20P_T3L_N2_AD1P_69) ; port DDR4_SDRAM.DDR4_ACT_B  [project net DDR4_PL0.DDR4_ACT_B]
DDR4_2_ALERT_B: IC18.A17(IO_L24P_T3U_N10_69) ; port DDR4_SDRAM.DDR4_ALERT_B  [project net DDR4_PL0.DDR4_ALERT_B]
DDR4_2_BA0: IC18.A19(IO_L20N_T3L_N3_AD1N_69) ; port DDR4_SDRAM.DDR4_BA0  [project net DDR4_PL0.DDR4_BA0]
DDR4_2_BA1: IC18.D16(IO_L23P_T3U_N8_69) ; port DDR4_SDRAM.DDR4_BA1  [project net DDR4_PL0.DDR4_BA1]
DDR4_2_BG0: IC18.K19(IO_L10P_T1U_N6_QBC_AD4P_69) ; port DDR4_SDRAM.DDR4_BG0  [project net DDR4_PL0.DDR4_BG0]
DDR4_2_CK_N: IC18.F17(IO_L13N_T2L_N1_GC_QBC_69) ; port DDR4_SDRAM.DDR4_CK_N  [project net DDR4_PL0.DDR4_CK_N]
DDR4_2_CK_P: IC18.G17(IO_L13P_T2L_N0_GC_QBC_69) ; port DDR4_SDRAM.DDR4_CK_P  [project net DDR4_PL0.DDR4_CK_P]
DDR4_2_CKE: IC18.H18(IO_L14P_T2L_N2_GC_69) ; port DDR4_SDRAM.DDR4_CKE  [project net DDR4_PL0.DDR4_CKE]
DDR4_2_CS_B: IC18.A16(IO_L24N_T3U_N11_69) ; port DDR4_SDRAM.DDR4_CS_B  [project net DDR4_PL0.DDR4_CS_B]
DDR4_2_DM0: IC18.F21(IO_L13P_T2L_N0_GC_QBC_67)
DDR4_2_DM1: IC18.C23(IO_L19P_T3L_N0_DBC_AD9P_67)
DDR4_2_DM2: IC18.K13(IO_L7P_T1L_N0_QBC_AD13P_68)
DDR4_2_DM3: IC18.J8(IO_L1P_T0L_N0_DBC_68)
DDR4_2_DM4: IC18.C12(IO_L19P_T3L_N0_DBC_AD9P_68)
DDR4_2_DM5: IC18.G13(IO_L13P_T2L_N0_GC_QBC_68)
DDR4_2_DM6: IC18.J23(IO_L7P_T1L_N0_QBC_AD13P_67)
DDR4_2_DM7: IC18.N20(IO_L1P_T0L_N0_DBC_67)
DDR4_2_DQ0: IC18.E24(IO_L15N_T2L_N5_AD11N_67)
DDR4_2_DQ1: IC18.E21(IO_L18P_T2U_N10_AD2P_67)
DDR4_2_DQ2: IC18.E23(IO_L17N_T2U_N9_AD10N_67)
DDR4_2_DQ3: IC18.D21(IO_L18N_T2U_N11_AD2N_67)
DDR4_2_DQ4: IC18.F24(IO_L15P_T2L_N4_AD11P_67)
DDR4_2_DQ5: IC18.G20(IO_L14P_T2L_N2_GC_67)
DDR4_2_DQ6: IC18.E22(IO_L17P_T2U_N8_AD10P_67)
DDR4_2_DQ7: IC18.F20(IO_L14N_T2L_N3_GC_67)
DDR4_2_DQ8: IC18.C22(IO_L21N_T3L_N5_AD8N_67)
DDR4_2_DQ9: IC18.A20(IO_L24P_T3U_N10_67)
DDR4_2_DQ10: IC18.C21(IO_L21P_T3L_N4_AD8P_67)
DDR4_2_DQ11: IC18.B20(IO_L23N_T3U_N9_67)
DDR4_2_DQ12: IC18.B24(IO_L20P_T3L_N2_AD1P_67)
DDR4_2_DQ13: IC18.C20(IO_L23P_T3U_N8_67)
DDR4_2_DQ14: IC18.A24(IO_L20N_T3L_N3_AD1N_67)
DDR4_2_DQ15: IC18.A21(IO_L24N_T3U_N11_67)
DDR4_2_DQ16: IC18.H10(IO_L12N_T1U_N11_GC_68)
DDR4_2_DQ17: IC18.K10(IO_L8N_T1L_N3_AD5N_68)
DDR4_2_DQ18: IC18.J11(IO_L11P_T1U_N8_GC_68)
DDR4_2_DQ19: IC18.J10(IO_L11N_T1U_N9_GC_68)
DDR4_2_DQ20: IC18.F10(IO_L9N_T1L_N5_AD12N_68)
DDR4_2_DQ21: IC18.K11(IO_L8P_T1L_N2_AD5P_68)
DDR4_2_DQ22: IC18.H11(IO_L12P_T1U_N10_GC_68)
DDR4_2_DQ23: IC18.F11(IO_L9P_T1L_N4_AD12P_68)
DDR4_2_DQ24: IC18.K9(IO_L2P_T0L_N2_68)
DDR4_2_DQ25: IC18.H6(IO_L3N_T0L_N5_AD15N_68)
DDR4_2_DQ26: IC18.J9(IO_L2N_T0L_N3_68)
DDR4_2_DQ27: IC18.H7(IO_L3P_T0L_N4_AD15P_68)
DDR4_2_DQ28: IC18.G9(IO_L6P_T0U_N10_AD6P_68)
DDR4_2_DQ29: IC18.G6(IO_L5N_T0U_N9_AD14N_68)
DDR4_2_DQ30: IC18.F9(IO_L6N_T0U_N11_AD6N_68)
DDR4_2_DQ31: IC18.G7(IO_L5P_T0U_N8_AD14P_68)
DDR4_2_DQ32: IC18.A14(IO_L24N_T3U_N11_68)
DDR4_2_DQ33: IC18.D13(IO_L20P_T3L_N2_AD1P_68)
DDR4_2_DQ34: IC18.B13(IO_L21N_T3L_N5_AD8N_68)
DDR4_2_DQ35: IC18.C13(IO_L20N_T3L_N3_AD1N_68)
DDR4_2_DQ36: IC18.B14(IO_L21P_T3L_N4_AD8P_68)
DDR4_2_DQ37: IC18.A11(IO_L23N_T3U_N9_68)
DDR4_2_DQ38: IC18.A15(IO_L24P_T3U_N10_68)
DDR4_2_DQ39: IC18.A12(IO_L23P_T3U_N8_68)
DDR4_2_DQ40: IC18.F14(IO_L15N_T2L_N5_AD11N_68)
DDR4_2_DQ41: IC18.E11(IO_L17N_T2U_N9_AD10N_68)
DDR4_2_DQ42: IC18.G14(IO_L15P_T2L_N4_AD11P_68)
DDR4_2_DQ43: IC18.F12(IO_L17P_T2U_N8_AD10P_68)
DDR4_2_DQ44: IC18.E14(IO_L18P_T2U_N10_AD2P_68)
DDR4_2_DQ45: IC18.H12(IO_L14N_T2L_N3_GC_68)
DDR4_2_DQ46: IC18.D14(IO_L18N_T2U_N11_AD2N_68)
DDR4_2_DQ47: IC18.H13(IO_L14P_T2L_N2_GC_68)
DDR4_2_DQ48: IC18.G22(IO_L11N_T1U_N9_GC_67)
DDR4_2_DQ49: IC18.J21(IO_L9P_T1L_N4_AD12P_67)
DDR4_2_DQ50: IC18.K24(IO_L8N_T1L_N3_AD5N_67)
DDR4_2_DQ51: IC18.H22(IO_L11P_T1U_N8_GC_67)
DDR4_2_DQ52: IC18.G23(IO_L12N_T1U_N11_GC_67)
DDR4_2_DQ53: IC18.H21(IO_L9N_T1L_N5_AD12N_67)
DDR4_2_DQ54: IC18.L24(IO_L8P_T1L_N2_AD5P_67)
DDR4_2_DQ55: IC18.H23(IO_L12P_T1U_N10_GC_67)
DDR4_2_DQ56: IC18.L21(IO_L3N_T0L_N5_AD15N_67)
DDR4_2_DQ57: IC18.N19(IO_L2P_T0L_N2_67)
DDR4_2_DQ58: IC18.L20(IO_L6N_T0U_N11_AD6N_67)
DDR4_2_DQ59: IC18.L19(IO_L6P_T0U_N10_AD6P_67)
DDR4_2_DQ60: IC18.L23(IO_L5N_T0U_N9_AD14N_67)
DDR4_2_DQ61: IC18.M19(IO_L2N_T0L_N3_67)
DDR4_2_DQ62: IC18.L22(IO_L5P_T0U_N8_AD14P_67)
DDR4_2_DQ63: IC18.M20(IO_L3P_T0L_N4_AD15P_67)
DDR4_2_DQS0_N: IC18.D24(IO_L16N_T2U_N7_QBC_AD3N_67) ; port DDR4_SDRAM.DDR4_DQS0_N  [project net DDR4_PL0.DDR4_DQS0_N]
DDR4_2_DQS0_P: IC18.D23(IO_L16P_T2U_N6_QBC_AD3P_67) ; port DDR4_SDRAM.DDR4_DQS0_P  [project net DDR4_PL0.DDR4_DQS0_P]
DDR4_2_DQS1_N: IC18.A22(IO_L22N_T3U_N7_DBC_AD0N_67) ; port DDR4_SDRAM.DDR4_DQS1_N  [project net DDR4_PL0.DDR4_DQS1_N]
DDR4_2_DQS1_P: IC18.B22(IO_L22P_T3U_N6_DBC_AD0P_67) ; port DDR4_SDRAM.DDR4_DQS1_P  [project net DDR4_PL0.DDR4_DQS1_P]
DDR4_2_DQS2_N: IC18.J13(IO_L10N_T1U_N7_QBC_AD4N_68) ; port DDR4_SDRAM.DDR4_DQS2_N  [project net DDR4_PL0.DDR4_DQS2_N]
DDR4_2_DQS2_P: IC18.J14(IO_L10P_T1U_N6_QBC_AD4P_68) ; port DDR4_SDRAM.DDR4_DQS2_P  [project net DDR4_PL0.DDR4_DQS2_P]
DDR4_2_DQS3_N: IC18.G8(IO_L4N_T0U_N7_DBC_AD7N_68) ; port DDR4_SDRAM.DDR4_DQS3_N  [project net DDR4_PL0.DDR4_DQS3_N]
DDR4_2_DQS3_P: IC18.H8(IO_L4P_T0U_N6_DBC_AD7P_68) ; port DDR4_SDRAM.DDR4_DQS3_P  [project net DDR4_PL0.DDR4_DQS3_P]
DDR4_2_DQS4_N: IC18.B15(IO_L22N_T3U_N7_DBC_AD0N_68) ; port DDR4_SDRAM.DDR4_DQS4_N  [project net DDR4_PL0.DDR4_DQS4_N]
DDR4_2_DQS4_P: IC18.C15(IO_L22P_T3U_N6_DBC_AD0P_68) ; port DDR4_SDRAM.DDR4_DQS4_P  [project net DDR4_PL0.DDR4_DQS4_P]
DDR4_2_DQS5_N: IC18.E12(IO_L16N_T2U_N7_QBC_AD3N_68) ; port DDR4_SDRAM.DDR4_DQS5_N  [project net DDR4_PL0.DDR4_DQS5_N]
DDR4_2_DQS5_P: IC18.E13(IO_L16P_T2U_N6_QBC_AD3P_68) ; port DDR4_SDRAM.DDR4_DQS5_P  [project net DDR4_PL0.DDR4_DQS5_P]
DDR4_2_DQS6_N: IC18.H20(IO_L10N_T1U_N7_QBC_AD4N_67) ; port DDR4_SDRAM.DDR4_DQS6_N  [project net DDR4_PL0.DDR4_DQS6_N]
DDR4_2_DQS6_P: IC18.J20(IO_L10P_T1U_N6_QBC_AD4P_67) ; port DDR4_SDRAM.DDR4_DQS6_P  [project net DDR4_PL0.DDR4_DQS6_P]
DDR4_2_DQS7_N: IC18.K22(IO_L4N_T0U_N7_DBC_AD7N_67) ; port DDR4_SDRAM.DDR4_DQS7_N  [project net DDR4_PL0.DDR4_DQS7_N]
DDR4_2_DQS7_P: IC18.K21(IO_L4P_T0U_N6_DBC_AD7P_67) ; port DDR4_SDRAM.DDR4_DQS7_P  [project net DDR4_PL0.DDR4_DQS7_P]
DDR4_2_ODT: IC18.D19(IO_T3U_N12_69) ; port DDR4_SDRAM.DDR4_ODT  [project net DDR4_PL0.DDR4_ODT]
DDR4_2_PAR: IC18.B18(IO_L22P_T3U_N6_DBC_AD0P_69) ; port DDR4_SDRAM.DDR4_PAR  [project net DDR4_PL0.DDR4_PAR]
DDR4_2_RESET_B: IC18.C18(IO_L19N_T3L_N1_DBC_AD9N_69) ; port DDR4_SDRAM.DDR4_RESET_B  [project net DDR4_PL0.DDR4_RESET_B]
FPGA_SDRAM0_CLK_N: IC18.J18(IO_L12N_T1U_N11_GC_69) R438.1 R535.2 ; port FPGA_CLK1.CLK_N
FPGA_SDRAM0_CLK_P: IC18.J19(IO_L12P_T1U_N10_GC_69) R437.1 R535.1 ; port FPGA_CLK1.CLK_P
FPGA_SYSREF_N: IC18.H16(IO_L11N_T1U_N9_GC_69) R436.1 R536.2 ; port SYSREF_FPGA.CLK_N
FPGA_SYSREF_P: IC18.H17(IO_L11P_T1U_N8_GC_69) R435.1 R536.1 ; port SYSREF_FPGA.CLK_P
MMC_MISO1: IC46.4(B2) ; port MMC_FPGA_SPI.MISO
MMC_MISO1_1V2: IC18.M15(IO_L2N_T0L_N3_69) IC46.9(A2)
MMC_MOSI1: IC45.5(B1) ; port MMC_FPGA_SPI.MOSI
MMC_MOSI1_1V2: IC18.N13(IO_L3P_T0L_N4_AD15P_69) IC45.8(A1)
MMC_SCK1: IC46.5(B1) ; port MMC_FPGA_SPI.SCK
MMC_SCK1_1V2: IC18.N15(IO_L2P_T0L_N2_69) IC46.8(A1)
MMC_SSEL1: IC45.4(B2) ; port MMC_FPGA_SPI.CSB
MMC_SSEL1_1V2: IC18.M13(IO_L3N_T0L_N5_AD15N_69) IC45.9(A2)
VbiasB_0.6V: C751.1 C752.1 C753.1 R434.2 R435.2 R436.2 R437.2 R438.2 R439.2
VREF68: IC18.K14(VREF_68) R533.2
VREF69: IC18.N16(VREF_69) R529.2
VREF_67: IC18.N18(VREF_67) R534.2
VRP67: IC18.K23(IO_T0U_N12_VRP_67) R195.2
VRP68: IC18.F7(IO_T0U_N12_VRP_68) R531.2
VRP69: IC18.L16(IO_T0U_N12_VRP_69) R296.2

Not connected (* = marked no-connect by the designer): IC18 A25(IO_T3U_N12_67) B12(IO_L19N_T3L_N1_DBC_AD9N_68) B23(IO_L19N_T3L_N1_DBC_AD9N_67) C11(IO_T3U_N12_68) C17(IO_L21P_T3L_N4_AD8P_69) D11(IO_T2U_N12_68) D20(IO_T2U_N12_67) F22(IO_L13N_T2L_N1_GC_QBC_67) G10(IO_T1U_N12_68) G12(IO_L13N_T2L_N1_GC_QBC_68) G24(IO_T1U_N12_67) H15(IO_L7N_T1L_N1_QBC_AD13N_69) J7(IO_L1N_T0L_N1_DBC_68) J15(IO_L7P_T1L_N0_QBC_AD13P_69) J24(IO_L7N_T1L_N1_QBC_AD13N_67) K12(IO_L7N_T1L_N1_QBC_AD13N_68) K17(IO_L8N_T1L_N3_AD5N_69) L12(IO_L5N_T0U_N9_AD14N_69) L14(IO_L4N_T0U_N7_DBC_AD7N_69) L15(IO_L4P_T0U_N6_DBC_AD7P_69) L17(IO_L8P_T1L_N2_AD5P_69) M12(IO_L5P_T0U_N8_AD14P_69) M14(IO_L1N_T0L_N1_DBC_69) M17(IO_L6N_T0U_N11_AD6N_69) M18(IO_T1U_N12_69) N14(IO_L1P_T0L_N0_DBC_69) N17(IO_L6P_T0U_N10_AD6P_69) N21(IO_L1N_T0L_N1_DBC_67)

### Buses and harness runs
bus DDR4_2_A[13..0]
bus DDR4_2_DM[7..0]
bus DDR4_2_DQ[63..0]

### Layout directives
differential pair: DDR4_PL0.DDR4_CK_N, DDR4_PL0.DDR4_CK_P, DDR4_PL0.DDR4_DQS0_N, DDR4_PL0.DDR4_DQS0_P, DDR4_PL0.DDR4_DQS1_N, DDR4_PL0.DDR4_DQS1_P, DDR4_PL0.DDR4_DQS2_N, DDR4_PL0.DDR4_DQS2_P, DDR4_PL0.DDR4_DQS3_N, DDR4_PL0.DDR4_DQS3_P, DDR4_PL0.DDR4_DQS4_N, DDR4_PL0.DDR4_DQS4_P, DDR4_PL0.DDR4_DQS5_N, DDR4_PL0.DDR4_DQS5_P, DDR4_PL0.DDR4_DQS6_N, DDR4_PL0.DDR4_DQS6_P, DDR4_PL0.DDR4_DQS7_N, DDR4_PL0.DDR4_DQS7_P, FPGA_SDRAM0_CLK_N, FPGA_SDRAM0_CLK_P, FPGA_SYSREF_N, FPGA_SYSREF_P

### Notes on the sheet
- P1V2
- Project/Equipment
- Document
- Designer
- Drawn by
- Check.by
- Copyright WUT ISE 2021
  This documentation describes Open Hardware and is licensed under CERN OHL v.1.1. You may redistribute and modify this documentaction under the terms of the CERN OHL v1.1.
  (http://ohwr.org/CERNOHL). This documentation is dristributed WITHOUT ANY EXPRESS OR IMPLIED WARRANTY, INCLUDING OF MERCHANTABLITY, SATISFACTORY QUALITY AND FITNESS FOR A PARTICULAR PURPOSE. Please see the CERN OHL v.1.1 for applicable conditions
- File
- Last Mod.
- Print Date
- Sheet
- Size
- A3
- of
- Rev
- Contact:
- (in symbol R0402_1K_1%_0.0625W_100PPM) 1%
- (in symbol R0402_10K_1%_0.0625W_100PPM) 1%
- (in symbol R0402_100R_1%_0.0625W_100PPM) 1%
- (in symbol R0402_240R_1%_0.0625W_100PPM) 1%
- (in symbol XCZU27DR-1FSVG1517E, part D) BANK 67
- (in symbol XCZU27DR-1FSVG1517E, part E) BANK 68
- (in symbol XCZU27DR-1FSVG1517E, part F) BANK 69

### Library data of the parts
C746 C747 C799 C800 = CC0201_100NF_6.3V_10%_X5R: Non-polarised capacitor; Manufacturer: GENERIC; Manufacturer1 Part Number: 02016D104KAT2A; Part Description: SMD Multilayer Chip Ceramic Capacitor; TC: X5R; Tolerance: ±10%; Voltage: 6.3V; Case: 0201; Manufacturer Part Number: CC0201_100NF_6.3V_10%_X5R; Manufacturer1 Example: AVX; Part Number: CC0201_100NF_6.3V_10%_X5R; Pin Count: 2; SMD: Yes; Status: Not Recommended; Value: 100nF; Component Kind: Standard; Component Type: Standard; Mounted: Yes; Socket: No; Sense: No; Manufacturer1 ComponentHeight: 0.33mm; HelpURL: \\cern.ch\dfs\Applications\Altium\Datasheets\CC0201_X5R_AVX.pdf; Author: CERN DEM JLC; CreateDate: 03.12.2007; LatestRevisionDate: 03.12.2007
C751-C753 = CC0201_100NF_6.3V_10%_X5R: as C576-C578 on sheet CDR_WR_oscillators; Manufacturer Part Number: CC0201_100NF_6.3V_10%_X5R; Part Number: CC0201_100NF_6.3V_10%_X5R; Value: 100nF; Component Kind: Standard; Component Type: Standard; Pin Count: 2; Status: Not Recommended; Case: 0201; Mounted: Yes; Socket: No; SMD: Yes; Sense: No; Manufacturer1 Example: AVX; Manufacturer1 ComponentHeight: 0.33mm; HelpURL: \\cern.ch\dfs\Applications\Altium\Datasheets\CC0201_X5R_AVX.pdf; Author: CERN DEM JLC; CreateDate: 03.12.2007; LatestRevisionDate: 03.12.2007
IC18 = XCZU27DR-1FSVG1517E: Zynq UltraScale+ RFSoC, Quad-Core ARM® Cortex™-A53 MPCore™ up to 1.5GHz, 214 PS I/O, 299 HP I/O, 48 HD I/O, 1517-Pin BGA; Manufacturer: XILINX; PressFit: No; Bonding: No; Part Number: XCZU27DR-1FSVG1517E; Component Kind: Standard; Component Type: Standard; Device: XCZU27DR-1FSVG1517E; PackageDescription: BGA, 1.00mm Pitch, Square; 1517 Pin, 39 Columns X 39 Rows, 40.00mm X 40.00mm X 4.01mm H; Part Description: Zynq UltraScale+ RFSoC, Quad-Core ARM® Cortex™-A53 MPCore™ up to 1.5GHz, 214 PS I/O, 299 HP I/O, 48 HD I/O, 1517-Pin BGA; Manufacturer Part Number: XCZU27DR-1FSVG1517E; Pin Count: 1517; Case: BGA1517; Mounted: Yes; Socket: No; SMD: Yes; Sense: No; ComponentHeight: 4.01mm; HelpURL: \\cern.ch\dfs\Applications\Altium\Datasheets\XCZU27DR-1FSVG1517E.pdf; ComponentLink1URL: \\cern.ch\dfs\Applications\Altium\Datasheets\XCZU27DR-1FSVG1517E_Package-Pinout.pdf; ComponentLink1Description: Package/Pinout; ComponentLink2URL: \\cern.ch\dfs\Applications\Altium\Datasheets\XCZU27DR-1FSVG1517E_Pinout.pdf; ComponentLink2Description: Pinout; Author: CERN DEM MR; CreateDate: 02/05/2018; LatestRevisionDate: 02/05/2018
IC45 IC46 = SN74AVC2T245RSWR: Dual-Bit Dual-Supply Bus Transceiver With Configurable Voltage Translation and 3-State Outputs; Manufacturer: TEXAS INSTRUMENTS; PressFit: No; Bonding: No; Manufacturer Part Number: SN74AVC2T245RSWR; PackageDescription: QFN, 0.40mm Pitch, Rect.;10 Pin, 1.80mm L X 1.40mm W X 0.55mm H Body, IPC Medium Density; Part Description: Dual-Bit Dual-Supply Bus Transceiver With Configurable Voltage Translation and 3-State Outputs; Part Number: SN74AVC2T245RSWR; Component Kind: Standard; Component Type: Standard; Device: SN74AVC2T245RSWR; Status: Not Recommended; Pin Count: 10; Case: QFN10; Mounted: Yes; Socket: No; SMD: Yes; Sense: No; ComponentHeight: 0.55mm; Author: CERN DEM JLC; HelpURL: \\cern.ch\dfs\Applications\Altium\Datasheets\SN74AVC2T245RSWR.pdf; CreateDate: 07.07.2014; LatestRevisionDate: 30.03.2017
R195 R296 R434 R439 R531 = R0402_240R_1%_0.0625W_100PPM: Resistor - 1%; Manufacturer: GENERIC; Part Description: General Purpose Thick Film Chip Resistor; Manufacturer1 Part Number: 232270672401L; TC: ±100ppm/°C; PressFit: No; Manufacturer Part Number: R0402_240R_1%_0.0625W_100PPM; Part Number: R0402_240R_1%_0.0625W_100PPM; Tolerance: ±1%; Value: 240; Component Kind: Standard; Component Type: Standard; Pin Count: 2; Status: Not Recommended; Power: 0.0625W; Case: 0402; Mounted: Yes; Sense: No; Socket: No; SMD: Yes; Manufacturer1 Example: YAGEO PHYCOMP; Manufacturer1 ComponentHeight: 0.4mm; HelpURL: \\cern.ch\dfs\Applications\Altium\Datasheets\R0402_Phycomp_RC0402.pdf; Author: CERN DEM JLC; CreateDate: 03.12.2007; LatestRevisionDate: 17.10.2012
R435-R438 = R0402_10K_1%_0.0625W_100PPM: as R107 on sheet Supply; Manufacturer Part Number: R0402_10K_1%_0.0625W_100PPM; Part Number: R0402_10K_1%_0.0625W_100PPM; Tolerance: ±1%; Value: 10k; Component Kind: Standard; Component Type: Standard; Pin Count: 2; Status: Not Recommended; Power: 0.0625W; Case: 0402; Mounted: Yes; Sense: No; Socket: No; SMD: Yes; Manufacturer1 Example: YAGEO PHYCOMP; Manufacturer1 ComponentHeight: 0.4mm; HelpURL: \\cern.ch\dfs\Applications\Altium\Datasheets\R0402_Phycomp_RC0402.pdf; Author: CERN DEM JLC; CreateDate: 03.12.2007; LatestRevisionDate: 17.10.2012
R529 R533 R534 = R0402_1K_1%_0.0625W_100PPM: Resistor - 1%; Manufacturer: GENERIC; Part Description: General Purpose Thick Film Chip Resistor; Manufacturer1 Part Number: 232270671002L; TC: ±100ppm/°C; PressFit: No; Manufacturer Part Number: R0402_1K_1%_0.0625W_100PPM; Part Number: R0402_1K_1%_0.0625W_100PPM; Tolerance: ±1%; Value: 1k; Component Kind: Standard; Component Type: Standard; Pin Count: 2; Status: Not Recommended; Power: 0.0625W; Case: 0402; Mounted: Yes; Sense: No; Socket: No; SMD: Yes; Manufacturer1 Example: YAGEO PHYCOMP; Manufacturer1 ComponentHeight: 0.4mm; HelpURL: \\cern.ch\dfs\Applications\Altium\Datasheets\R0402_Phycomp_RC0402.pdf; Author: CERN DEM JLC; CreateDate: 03.12.2007; LatestRevisionDate: 17.10.2012
R535 R536 = R0402_100R_1%_0.0625W_100PPM: Resistor - 1%; Manufacturer: GENERIC; Part Description: General Purpose Thick Film Chip Resistor; Manufacturer1 Part Number: 232270671001L; TC: ±100ppm/°C; PressFit: No; Manufacturer Part Number: R0402_100R_1%_0.0625W_100PPM; Part Number: R0402_100R_1%_0.0625W_100PPM; Tolerance: ±1%; Value: 100; Component Kind: Standard; Component Type: Standard; Pin Count: 2; Status: Not Recommended; Power: 0.0625W; Case: 0402; Mounted: Yes; Sense: No; Socket: No; SMD: Yes; Manufacturer1 Example: YAGEO PHYCOMP; Manufacturer1 ComponentHeight: 0.4mm; HelpURL: \\cern.ch\dfs\Applications\Altium\Datasheets\R0402_Phycomp_RC0402.pdf; Author: CERN DEM JLC; CreateDate: 03/12/2007; LatestRevisionDate: 17/10/2012